# EAGLE design breakout (EAGLE 9.6.2)
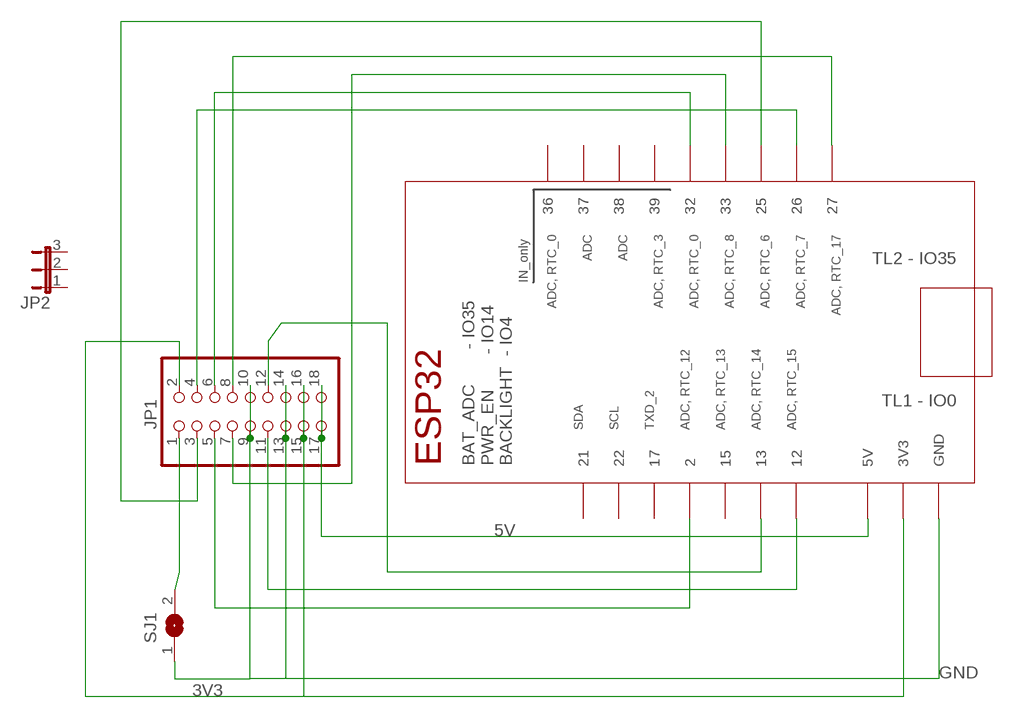
[diagram p0: schematic, sheet 1]

## Parts
IC1  TTGO_DISP  [TTGO_DISP_DEFAULT]
JP1  PINHD-2X9-BIG  [2X09-BIG]
JP2  JUMPER3  [JUMPER3]
SJ1  SOLDERJUMPERREFLOW  [SOLDERJUMPER_REFLOW]

## Nets
3V3: IC1.3V3_1(3V3) IC1.3V3_2(3V3) JP1.2 JP1.15 JP1.16
5V: IC1.5V JP1.17 JP1.18
GND: IC1.GND_1(GND) IC1.GND_2(GND) IC1.GND_3(GND) IC1.GND_4(GND) IC1.GND_5(GND) JP1.9 JP1.10 JP1.13 JP1.14 SJ1.1
N$1: IC1.13 JP1.12
N$2: JP1.1 SJ1.2
N$4: IC1.27 JP1.8
N$5: IC1.33 JP1.7
N$6: IC1.32 JP1.6
N$7: IC1.26 JP1.4
N$8: IC1.2 JP1.5
N$9: IC1.25 JP1.3
N$13: IC1.12 JP1.11
Unconnected: IC1.15 IC1.17 IC1.21 IC1.22 IC1.36 IC1.37 IC1.38 IC1.39 JP2.1 JP2.2 JP2.3

## Library data of the parts
IC1 = TTGO_LCD_DISP:TTGO_DISP; HEIGHT: 11
JP1 = adafruit:PINHD-2X9: PIN HEADER With larger annulars
JP2 = microbuilder:JUMPER3: JUMPER - 3 Pins
SJ1 = microbuilder:SOLDERJUMPER: SMD Solder JUMPER Solder the two pads together to create a connection, or remove the solder to break it. REFLOW - Use this footprint for solder paste and reflow ovens. WAVE - Use this footprint for hand-soldering (larger pads). CLOSED - Has a trace between the two pads to ensure it is closed by default. The trace needs to be cut to disable the jumper, and can be closed again by creating a solder bridge between the two pads.

## Board
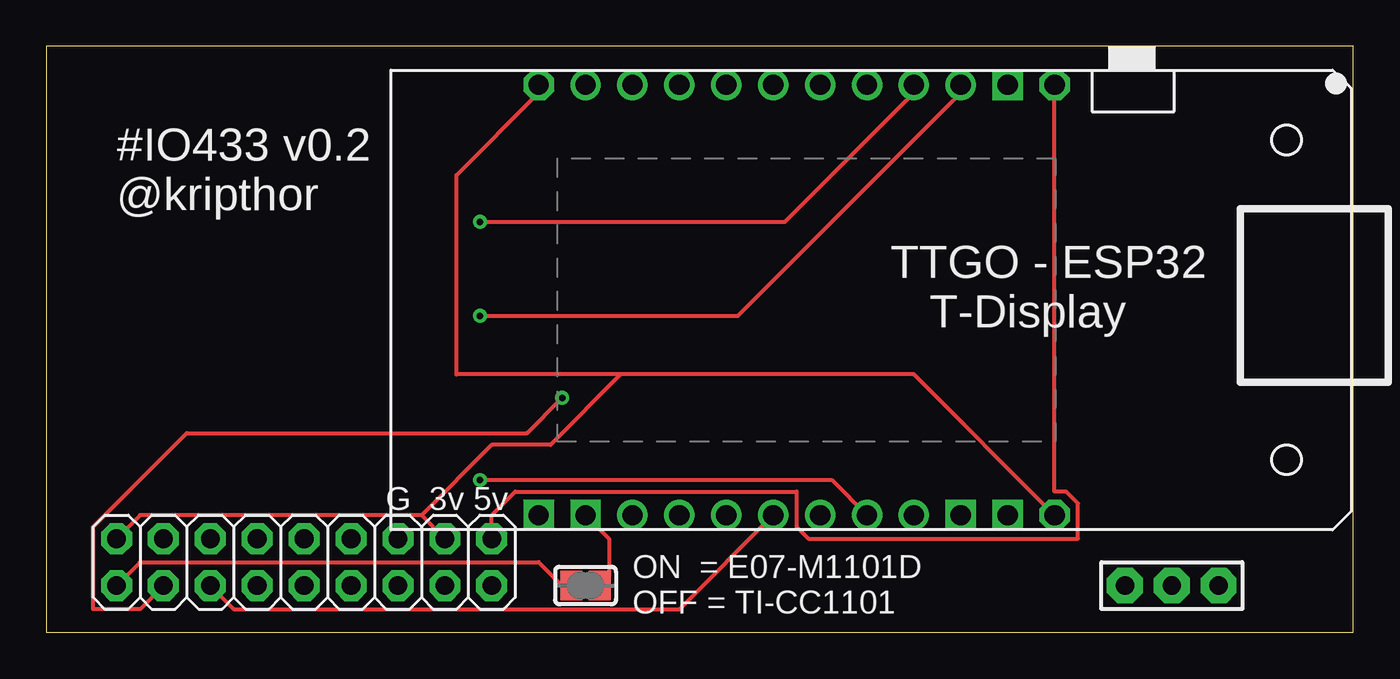
[diagram p1: board, top side]
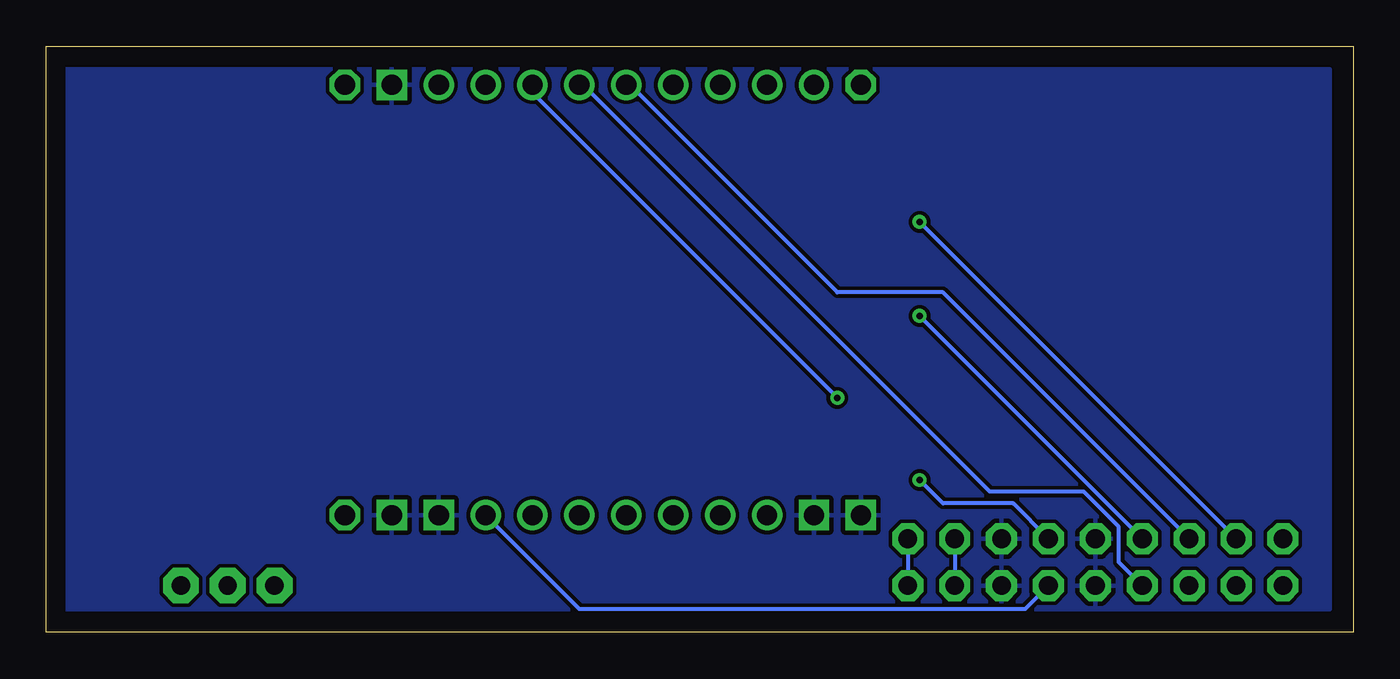
[diagram p2: board, bottom side, seen from below]

Size 70.79 x 31.74 mm. Coordinates in mm from the lower left corner, seen from the top.
Outline: 0,0 70.79,0 70.79,31.74 0,31.74 0,0
Copper layers (1*16): Top 0.035mm / dielectric 1.5mm / Bottom 0.035mm
Design rules "default *": minimum track width 8mil, minimum drill 0.35mm, track to track 8mil, track to pad 8mil, pad to pad 8mil, via to via 8mil, smd to smd 8mil, copper to edge 40mil, drill to drill 8mil, minimum pad ring 10mil, minimum via ring 8mil, stop-mask expansion 4mil, vias tented up to drill 0mil, thermal gap 10mil

### Footprints (pad centres in the part's own frame; a part is rotated, then mirrored left to right if it is on the bottom)
TTGO_DISP_DEFAULT = drill 1.1: 2 12.7,0; 12 20.32,0; 13 17.78,0; 15 15.24,0; 17 10.16,0; 21 5.08,0; 22 7.62,0; 25 17.78,23.3; 26 20.32,23.3; 27 22.86,23.3; 32 12.7,23.3; 33 15.24,23.3; 36 2.54,23.3; 37 5.08,23.3; 38 7.62,23.3; 39 10.16,23.3 | drill 1.1 octagon: 3V3_1 0,23.3; 3V3_2 27.94,0; 5V 27.94,23.3 | drill 1.1 square: GND_1 0,0; GND_2 2.54,0; GND_3 22.86,0; GND_4 25.4,0; GND_5 25.4,23.3
2X09-BIG = drill 1.016 pad 1.676 octagon: 1 -10.16,-1.27; 2 -10.16,1.27; 3 -7.62,-1.27; 4 -7.62,1.27; 5 -5.08,-1.27; 6 -5.08,1.27; 7 -2.54,-1.27; 8 -2.54,1.27; 9 0,-1.27; 10 0,1.27; 11 2.54,-1.27; 12 2.54,1.27; 13 5.08,-1.27; 14 5.08,1.27; 15 7.62,-1.27; 16 7.62,1.27; 17 10.16,-1.27; 18 10.16,1.27
JUMPER3 = drill 1 pad 1.93 octagon: 1 -2.54,0; 2 0,0; 3 2.54,0
SOLDERJUMPER_REFLOW = smd 1.168 x 1.6: 1 -0.762,0; 2 0.762,0

### Placement (x,y rotation side)
IC1  26.67,6.35 0 top
JP1  13.97,3.81 0 top
JP2  60.96,2.54 180 top
SJ1  29.21,2.54 180 top

### Tracks (layer width: path | path; a pad name or v marks a point on that pad's centre or on a via)
3V3
  Top 0.203: JP1.2 5.08,6.35 20.32,6.35 | JP1.16 20.32,6.35 | 31.11,13.97 46.99,13.97 IC1.3V3_2 | 31.11,13.97 22.23,13.97 22.23,24.77 26.67,29.21 IC1.3V3_1 | 20.32,6.35 24.13,10.16 27.3,10.16 31.11,13.97
  Bottom 0.203: JP1.16 JP1.15
5V
  Top 0.203: IC1.5V 54.61,7.62 55.24,7.62 55.88,6.99 55.88,5.08 41.27,5.08 40.64,5.71 40.64,7.62 25.4,7.62 24.13,6.35 JP1.18
  Bottom 0.203: JP1.18 JP1.17
GND
  Top 0.203: IC1.GND_2 30.48,5.08 30.48,3.05 SJ1.1
  pour Bottom: 1.27,30.48 69.85,30.48 69.85,1.27 1.27,1.27
N$1  (via drill 0.35)
  Top 0.203: IC1.13 42.54,8.26 v23.5,8.26
  Bottom 0.203: v23.5,8.26 22.23,6.99 18.41,6.99 JP1.12
N$2
  Top 0.203: JP1.1 5.08,3.81 26.67,3.81 27.94,2.54 SJ1.2
N$4  (via drill 0.35)
  Top 0.203: v23.5,17.14 37.46,17.14 49.53,29.21 IC1.27
  Bottom 0.203: JP1.8 v23.5,17.14
N$5
  Bottom 0.203: JP1.7 12.7,3.81 12.7,5.71 14.61,7.62 19.68,7.62 41.27,29.21 41.91,29.21 IC1.33
N$6
  Bottom 0.203: JP1.6 22.23,18.41 27.94,18.41 38.73,29.21 39.37,29.21 IC1.32
N$7  (via drill 0.35)
  Top 0.203: v23.5,22.23 40,22.23 46.99,29.21 IC1.26
  Bottom 0.203: JP1.4 v23.5,22.23
N$8
  Top 0.203: IC1.2 34.29,1.27 10.16,1.27 JP1.5
N$9  (via drill 0.35)
  Top 0.203: v27.94,12.7 26.04,10.79 7.62,10.79 2.54,5.71 2.54,1.27 5.08,1.27 JP1.3
  Bottom 0.203: v27.94,12.7 44.45,29.21 IC1.25
N$13
  Bottom 0.203: IC1.12 41.91,1.27 17.78,1.27 JP1.11

### Text on the board
tPlace: #IO433 v0.2 / @kripthor | TTGO - ESP32 / T-Display | G 3v 5v | ON = E07-M1101D / OFF = TI-CC1101